# Altium schematic sheet led-monitoring-SN74HC365PW.SchDoc: SN74HC365PW LED Monitoring
size A4; DrawnBy: Dylan Vogel; Organization: UTAT SS; Revision: 1.1
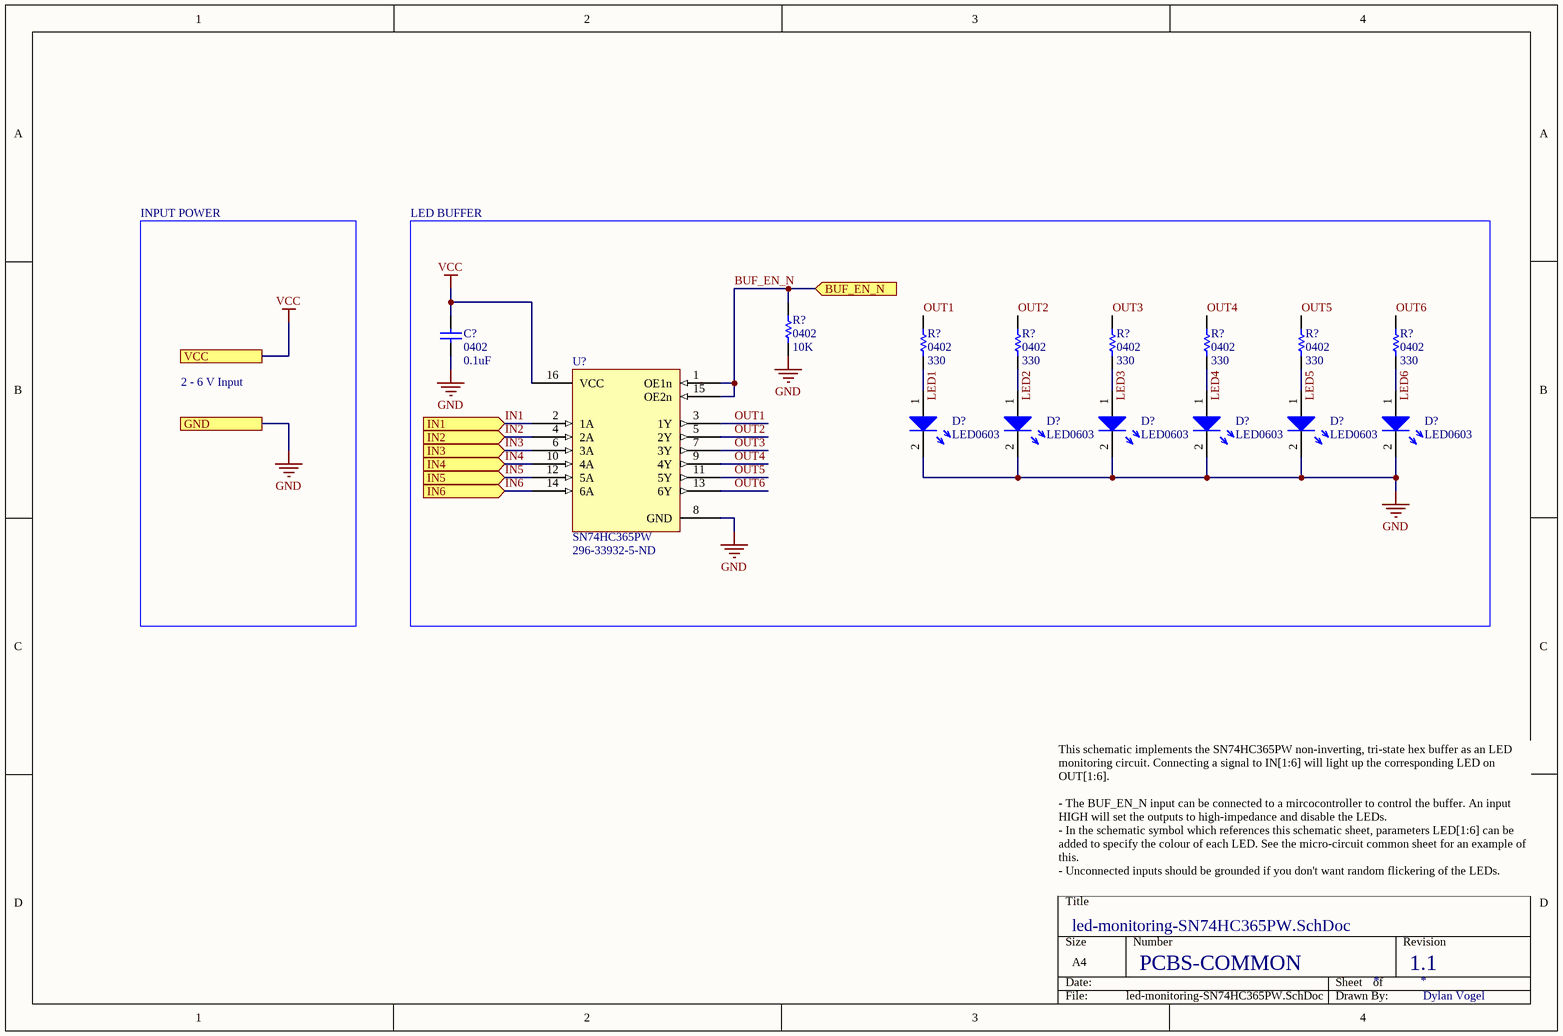
[diagram p0: led-monitoring-SN74HC365PW.SchDoc]

## Parts
(Parts that share a designator on the sheet are numbered #1, #2 ... from top to bottom, then left to right.)
C?  0402  value 0.1uF  [CAP0402R]
D?#1  LED0603  [LED0603]
D?#2  LED0603  [LED0603]
D?#3  LED0603  [LED0603]
D?#4  LED0603  [LED0603]
D?#5  LED0603  [LED0603]
D?#6  LED0603  [LED0603]
R?#1  0402  value 10K  [RES0402R]
R?#2  0402  value 330  [RES0402R]
R?#3  0402  value 330  [RES0402R]
R?#4  0402  value 330  [RES0402R]
R?#5  0402  value 330  [RES0402R]
R?#6  0402  value 330  [RES0402R]
R?#7  0402  value 330  [RES0402R]
U?  SN74HC365PW  Supplier Part Number 1: 296-33932-5-ND  [SOP65P640X120-16N]

## Blocks framed on the sheet
LED BUFFER: C? D?#1-D?#6 R?#1-R?#7 U?

## Ports
BUF_EN_N (in), GND, IN1 (in), IN2 (in), IN3 (in), IN4 (in), IN5 (in), IN6 (in), VCC

## Nets
GND: C?.1 D?#1.2 D?#2.2 D?#3.2 D?#4.2 D?#5.2 D?#6.2 R?#1.1 U?.8(GND) ; port GND
VCC: C?.2 U?.16(VCC) ; port VCC
BUF_EN_N: R?#1.2 U?.1(OE1n) U?.15(OE2n) ; port BUF_EN_N
IN1: U?.2(1A) ; port IN1
IN2: U?.4(2A) ; port IN2
IN3: U?.6(3A) ; port IN3
IN4: U?.10(4A) ; port IN4
IN5: U?.12(5A) ; port IN5
IN6: U?.14(6A) ; port IN6
LED1: D?#1.1 R?#2.1
LED2: D?#2.1 R?#3.1
LED3: D?#3.1 R?#4.1
LED4: D?#4.1 R?#5.1
LED5: D?#5.1 R?#6.1
LED6: D?#6.1 R?#7.1
OUT1: R?#2.2 U?.3(1Y)
OUT2: R?#3.2 U?.5(2Y)
OUT3: R?#4.2 U?.7(3Y)
OUT4: R?#5.2 U?.9(4Y)
OUT5: R?#6.2 U?.11(5Y)
OUT6: R?#7.2 U?.13(6Y)

## Notes on the sheet
- INPUT POWER
- 2 - 6 V Input
- This schematic implements the SN74HC365PW non-inverting, tri-state hex buffer as an LED monitoring circuit. Connecting a signal to IN[1:6] will light up the corresponding LED on OUT[1:6].
  - The BUF_EN_N input can be connected to a mircocontroller to control the buffer. An input HIGH will set the outputs to high-impedance and disable the LEDs.
  - In the schematic symbol which references this schematic sheet, parameters LED[1:6] can be added to specify the colour of each LED. See the micro-circuit common sheet for an example of this.
  - Unconnected inputs should be grounded if you don't want random flickering of the LEDs.
- PCBS-COMMON

## Library data of the parts
C? = CAP0402: 0402 capacitor; Manufacturer: Taiyo Yuden; Manufacturer Part Number: EMK105B7104KVHF; Description: Multilayer Ceramic Capacitors MLCC - SMD/SMT 0.1uF 16V X7R +/-10% 0402 AEC-Q200; Voltage Rating: 16V; Capacitance: 100nF; Tolerance: 10%; Dielectric: X7R; Supplier 1: Digi-Key; Supplier Part Number 1: 587-3807-1-ND; Stock 1: 18196; Pricing 1: 1=0.1, 10=0.057, 100=0.0254, 500=0.01812, 1000=0.01423, 2500=0.01294, 5000=0.0119 (USD); Mount: Surface Mount; Case/Package: 0402; Weight: 2.3E-05oz; Case Code (Metric): 1005; Case Code (Imperial): 0402; Min Operating Temperature: -55°C; Max Operating Temperature: 125°C; Package Quantity: 10000; Packaging: Tape and Reel; Termination: SMD/SMT; Voltage Rating (DC): 16V; Length: 0.039inch; Height: 0.5mm; Width: 0.02inch; Thickness: 0.022inch; Ratings: AEC-Q200; Lead Free: Lead Free; Halogen Free: Halogen Free
D?#1-D?#6 = LED0603: Generic 0603 LED. Use ChipLED from Osram for generic ones.
R?#1 = RES0402: 0402 resistor; Manufacturer: Panasonic; Manufacturer Part Number: ERJ-2RKF1002X; Description: RES SMD 10K OHM 1% 1/10W 0402; Resistance: 10kR; Power Rating: 100mW; Tolerance: 1%; Voltage Rating: 50V; Temperature Coefficient: 100ppm/°C; Supplier 1: Digi-Key; Supplier Part Number 1: P10.0KLCT-ND; Stock 1: 14350001; Pricing 1: 1=0.1, 10=0.045, 100=0.0183, 1000=0.00823, 2500=0.00715, 5000=0.0059 (USD); Mount: Surface Mount; Case/Package: 0402; Number of Pins: 2; Case Code (Metric): 1005; Case Code (Imperial): 0402; Contact Plating: Tin; Min Operating Temperature: -55°C; Max Operating Temperature: 155°C; Packaging: Tape and Reel; Package Quantity: 1; Composition: Thick Film; Number of Terminations: 2; Termination: SMD/SMT; Military Standard: Not; Max Power Dissipation: 100mW; Voltage Rating (DC): 50V; Features: Automotive AEC-Q200; Length: 1mm; Height: 0.35mm; Width: 0.02inch; Depth: 0.5mm; Radiation Hardening: No; REACH SVHC: No SVHC; Lead Free: Lead Free; ComponentLink1URL: http://industrial.panasonic.com/www-data/pdf/AOA0000/AOA0000CE2.pdf?src-supplier=Future+Electronics; ComponentLink1Description: http://industrial.panasonic.com/www-data/pdf/AOA0000/AOA0000CE2.pdf?src-supplier=Future+Electronics; ComponentLink2URL: http://industrial.panasonic.com/www-data/pdf/AOA0000/AOA0000CE2.pdf?src-supplier=Avnet+Europe; ComponentLink2Description: http://industrial.panasonic.com/www-data/pdf/AOA0000/AOA0000CE2.pdf?src-supplier=Avnet+Europe; ComponentLink3URL: https://industrial.panasonic.com/cdbs/www-data/pdf/RDA0000/DMA0000COL11.pdf?src-supplier=Mouser; ComponentLink3Description: https://industrial.panasonic.com/cdbs/www-data/pdf/RDA0000/DMA0000COL11.pdf?src-supplier=Mouser; ComponentLink4URL: http://www.farnell.com/datasheets/1678782.pdf?src-supplier=Element14; ComponentLink4Description: http://www.farnell.com/datasheets/1678782.pdf?src-supplier=Element14; ComponentLink5URL: http://www.farnell.com/datasheets/1911175.pdf?src-supplier=Farnell; ComponentLink5Description: http://www.farnell.com/datasheets/1911175.pdf?src-supplier=Farnell; ComponentLink6URL: http://www.jameco.com/Jameco/Products/ProdDS/1987020.pdf?src-supplier=Jameco; ComponentLink6Description: http://www.jameco.com/Jameco/Products/ProdDS/1987020.pdf?src-supplier=Jameco; ComponentLink7URL: http://industrial.panasonic.com/www-data/pdf/AOA0000/AOA0000CE2.pdf?src-supplier=Avnet; ComponentLink7Description: http://industrial.panasonic.com/www-data/pdf/AOA0000/AOA0000CE2.pdf?src-supplier=Avnet; ComponentLink8URL: http://www.alliedelec.com/m/d/623f45ff1957d936ff56d46fd1c28cac.pdf?src-supplier=Allied+Electronics; ComponentLink8Description: http://www.alliedelec.com/m/d/623f45ff1957d936ff56d46fd1c28cac.pdf?src-supplier=Allied+Electronics
R?#2-R?#7 = RES0402: 0402 resistor; Manufacturer: TE Connectivity; Manufacturer Part Number: CRGCQ0402F330R; Description: CRGCQ 0402 330R 1%; Resistance: 330R; Tolerance: 1%; Max Power Dissipation: 63mW; Temperature Coefficient: 100ppm/°C; Supplier 1: Digi-Key; Supplier Part Number 1: A129621CT-ND; Stock 1: 224275; Pricing 1: 1=0.1, 10=0.022, 100=0.009, 1000=0.00406, 2500=0.00352, 5000=0.00291 (USD); Case/Package: 0402; Case Code (Imperial): 0402; Case Code (Metric): 1005; Min Operating Temperature: -55°C; Max Operating Temperature: 155°C; Composition: Thick Film; Features: Moisture Resistant,Automotive AEC-Q200; Packaging: Tape and Reel; Number of Terminations: 2
U? = SN74HC365PW: Hex non-inverting buffer with 3-state outputs; Supplier 1: Digi-Key